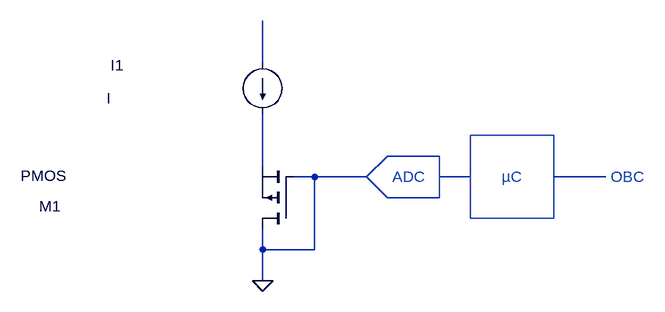
[diagram p0: schematic conceptual_block_diagram.asc]
conceptual_block_diagram.asc, the LTspice schematic file:
Version 4
SHEET 1 880 680
WIRE 16 16 16 -48
WIRE 288 160 208 160
WIRE 16 176 16 96
WIRE 96 192 64 192
WIRE 176 192 96 192
WIRE 336 192 288 192
WIRE 544 192 464 192
WIRE 288 224 208 224
WIRE 16 304 16 272
WIRE 96 304 96 192
WIRE 96 304 16 304
WIRE 16 352 16 304
FLAG 16 352 0
SYMBOL pmos 64 272 R180
WINDOW 0 358 35 Left 2
WINDOW 3 350 82 Left 2
SYMATTR InstName M1
SYMBOL current 16 16 R0
WINDOW 0 -234 4 Left 2
WINDOW 3 -240 55 Left 2
SYMATTR InstName I1
TEXT 216 192 Left 2 ;ADC
TEXT 384 192 Left 2 ;µC
TEXT 552 192 Left 2 ;OBC
LINE Normal 288 224 288 160
LINE Normal 208 160 176 192
LINE Normal 176 192 208 224
RECTANGLE Normal 464 256 336 128

The netlist it stands for:
* conceptual_block_diagram.asc
M1 0 0 N003 N003 PMOS
I1 N001 N003 I
.model NMOS NMOS
.model PMOS PMOS
.lib standard.mos
* ADC
* µC
* OBC
.backanno
.end